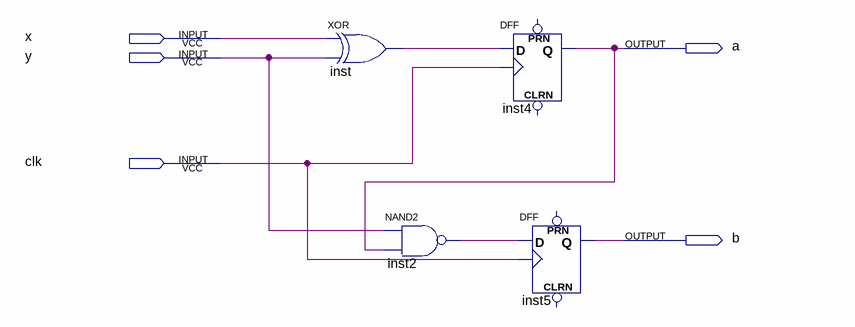
[diagram p0: schematic sheet]
// Quartus schematic new.bdf as structural Verilog: 4 symbols, 5 pins
module \new  (
  input  x,
  input  y,
  input  clk,
  output a,
  output b
);

  wire inst2_out, inst_out;

  xor inst (inst_out, x, y);
  nand inst2 (inst2_out, y, a);
  DFF inst4 (.CLK(clk), .D(inst_out), .Q(a));  // open: CLRN, PRN
  DFF inst5 (.CLK(clk), .D(inst2_out), .Q(b));  // open: CLRN, PRN
endmodule
